# Altium schematic sheet Power_Supply.SchDoc
size A4; SheetNumber: 4; SheetTotal: 6
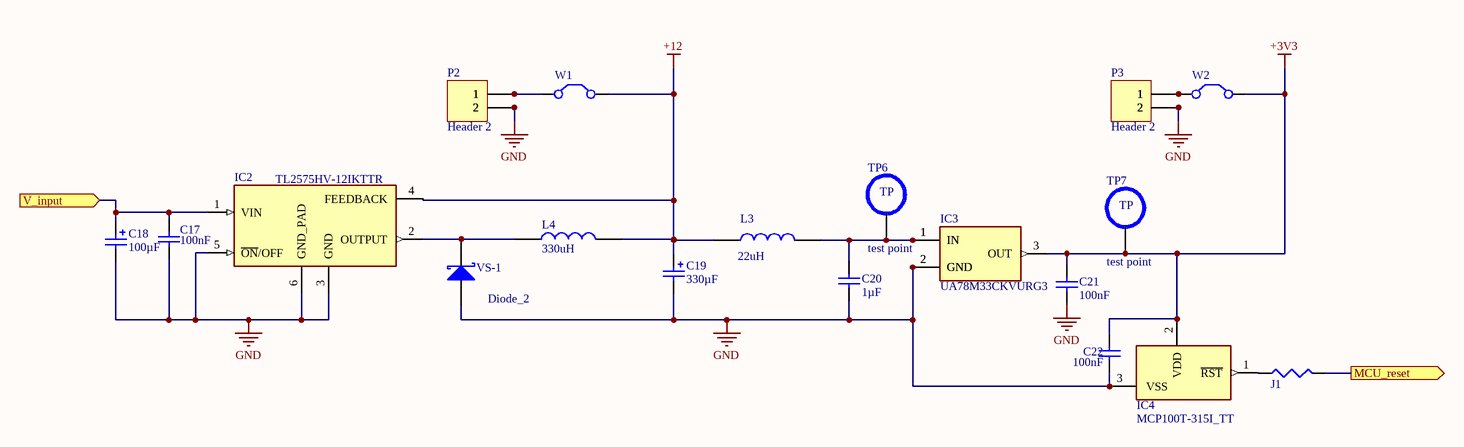
[diagram p0: Power_Supply.SchDoc]

## Parts
C17  value 100nF  [CAPC3216X180N]  (hidden comment: CC1206KKX7R0BB104)
C18  value 100µF  [EEEFK0J332AV]  (hidden comment: EEV-FK1K101V)
C19  value 330µF  [EEE0JA471UAP]  (hidden comment: EEEFK1E331P)
C20  value 1µF  [CAPC3216X180N]  (hidden comment: C1206C105M5REC7210)
C21  value 100nF  [CAPC3216X180N]  (hidden comment: CC1206KKX7R0BB104)
C22  value 100nF  [CAPC3216X180N]  (hidden comment: CC1206KKX7R0BB104)
IC2  TL2575HV-12IKTTR  [TO170P1524X483-6N]
IC3  UA78M33CKVURG3  [TPS7A6533QKVURQ1]
IC4  MCP100T-315I_TT  [SOT96P237X112-3N]
J1  MCWR12X000 PTL  [RESC3216X75N]  (value not drawn)
L3  22uH  [INDPM6965X300N]
L4  330uH  [WE-PD_7332/7345_PLASTIC_BASE54]
P2  Header 2  [HDR1X2]
P3  Header 2  [HDR1X2]
TP6  test point  [Test point]
TP7  test point  [Test point]
VS-1  Diode_2  [DIOM5436X244N]
W1  Jumper  [RAD-0.2]  (value not drawn)
W2  Jumper  [RAD-0.2]  (value not drawn)

## Ports
MCU_reset (out), V_input (in)

## Nets
+3V3: C21.2 C22.2 IC3.3(OUT) IC4.2(VDD) TP7.5 W2.2(C2)
+12: C19.1 IC2.4(FEEDBACK) L3.1 L4.2 W1.2(C2)
GND: C17.1 C18.2 C19.2 C20.1 C21.1 C22.1 IC2.3(GND) IC2.5(~{ON}/OFF) IC2.6(GND_PAD) IC3.2(GND) IC4.3(VSS) P2.2 P3.2 VS-1.2(A)
MCU_reset: J1.2 ; port MCU_reset
V_input: C17.2 C18.1 IC2.1(VIN) ; port V_input
NetC20_2: C20.2 IC3.1(IN) L3.2 TP6.5
NetIC2_2: IC2.2(OUTPUT) L4.1 VS-1.1(K)
NetIC4_1: IC4.1(~{RST}) J1.1
NetP2_1: P2.1 W1.1(C1)
NetP3_1: P3.1 W2.1(C1)

## Notes on the sheet
- (in symbol test point) TP

## Library data of the parts
C17 C21 C22 = CC1206KKX7R0BB104: Capacitor 100nF; Published: 8-Jun-2000; LatestRevisionDate: 17-Jul-2002; LatestRevisionNote: Re-released for DXP Platform.; PackageReference: RAD-0.3; Publisher: Altium Limited; PackageDescription: Radial Cap, Thru-Hole; 2 Leads; 0.3 in Pin Spacing; Supplier 1: Farnell
C18 = EEV-FK1K101V: Capacitor 100uF; Manufacturer_Name: Panasonic; Datasheet Link: http://industrial.panasonic.com/cdbs/www-data/pdf/RDE0000/ABA0000C1181.pdf; Height: 14.3mm; Manufacturer_Part_Number: EEV-FK1K101V; Mouser Part Number: 667-EEV-FK1K101V; Mouser Price/Stock: https://www.mouser.co.uk/ProductDetail/Panasonic/EEV-FK1K101V?qs=MtOUKumLmnbTFvRMlB7%2FdA%3D%3D; Supplier 1: Mouser
C19 = EEEFK1E331P: Capacitor 330uF; Manufacturer_Name: Panasonic; Manufacturer_Part_Number: EEV-FK1K101V; Datasheet Link: http://industrial.panasonic.com/cdbs/www-data/pdf/RDE0000/ABA0000C1181.pdf; Height: 14.3mm; Mouser Part Number: 667-EEV-FK1K101V; Mouser Price/Stock: https://www.mouser.co.uk/ProductDetail/Panasonic/EEV-FK1K101V?qs=MtOUKumLmnbTFvRMlB7%2FdA%3D%3D; Supplier 1: Mouser
C20 = C1206C105M5REC7210: Capacitor 1uF; Published: 8-Jun-2000; LatestRevisionDate: 17-Jul-2002; LatestRevisionNote: Re-released for DXP Platform.; PackageReference: RAD-0.3; Publisher: Altium Limited; PackageDescription: Radial Cap, Thru-Hole; 2 Leads; 0.3 in Pin Spacing; Supplier 1: Farnell
IC2 = TL2575HV-12IKTTR: Integrated Circuit; Manufacturer_Name: Texas Instruments; Datasheet Link: http://www.ti.com/lit/ds/symlink/tl2575-15.pdf; Height: 5.13mm; Manufacturer_Part_Number: TL2575HV-12IKTTR; Mouser Part Number: 595-TL2575HV-12IKTTR; Mouser Price/Stock: https://www.mouser.co.uk/ProductDetail/Texas-Instruments/TL2575HV-12IKTTR?qs=EnLMdcWnKADDmW7d51Om1g%3D%3D; Arrow Part Number: TL2575HV-12IKTTR; Arrow Price/Stock: https://www.arrow.com/en/products/tl2575hv-12ikttr/texas-instruments?region=nac
IC3 = UA78M33CKVURG3: Integrated Circuit; Manufacturer_Name: Texas Instruments; Datasheet Link: https://www.ti.com/lit/gpn/ua78m?HQS=ti-null-null-sf-df-pf-sep-wwe&DCM=yes; Height: 2.52mm; Manufacturer_Part_Number: UA78M33CKVURG3; Mouser Part Number: 595-UA78M33CKVURG3; Mouser Price/Stock: https://www.mouser.co.uk/ProductDetail/Texas-Instruments/UA78M33CKVURG3?qs=0O%2FZFlpUpJXrDg4gfD1Q2g%3D%3D; Arrow Part Number: UA78M33CKVURG3; Arrow Price/Stock: https://www.arrow.com/en/products/ua78m33ckvurg3/texas-instruments
IC4 = MCP100T-315I_TT: Integrated Circuit; Manufacturer_Name: Microchip; Manufacturer_Part_Number: MCP100T-315I/TT; Datasheet Link: http://docs-emea.rs-online.com/webdocs/0d03/0900766b80d034b8.pdf; Height: 1.12mm; Mouser Part Number: 579-MCP100T-315I/TT; Mouser Price/Stock: https://www.mouser.co.uk/ProductDetail/Microchip-Technology/MCP100T-315I-TT?qs=cQYLKLPzRJnnE4Sa6znIFg%3D%3D; Arrow Part Number: MCP100T-315I/TT; Arrow Price/Stock: https://www.arrow.com/en/products/mcp100t-315itt/microchip-technology?region=nac
J1 = MCWR12X000 PTL: Zero ohm resistor; Value: 0
L3 = IHLP2525CZER220M11: Inductor 22uH; Manufacturer_Name: Vishay; Datasheet Link: https://componentsearchengine.com/Datasheets/1/IHLP2525CZER220M11.pdf; Height: 3mm; Manufacturer_Part_Number: IHLP2525CZER220M11; Mouser Part Number: 70-IHLP2525CZER220; Mouser Price/Stock: https://www.mouser.co.uk/ProductDetail/Vishay-Dale/IHLP2525CZER220M11?qs=sy7P%252B1cA09hqmhD2Kelr6g%3D%3D; Arrow Part Number: IHLP2525CZER220M11; Arrow Price/Stock: https://www.arrow.com/en/products/ihlp2525czer220m11/vishay?region=europe; Value: 22uH
L4 = 7447789233: Inductor 330uH; Manufacturer_Name: Wurth Elektronik; Manufacturer_Part_Number: 7447789233
P2 P3 = Header 2: Header, 2-Pin; LatestRevisionDate: 17-Jul-2002; LatestRevisionNote: Re-released for DXP Platform.; Publisher: Altium Limited
VS-1 = Diode_2: Schottky Rectifier / VS-10BQ060-M3/5BT; Note: Terminal 2 is the TAB and is electrically connected to the cathode; Published: 8-Jun-2000; LatestRevisionDate: 17-Jul-2002; LatestRevisionNote: Re-released for DXP Platform.; DatasheetVersion: PD-2.057B; PackageVersion: Feb-1998; PackageReference: TO-220AC; Publisher: Altium Limited; PackageDescription: TO, Thru-Hole, Vertical, Heatsink Mounted; 3 In-Line Leads (1 Absent); Pitch 2.54 mm; ComponentLink1Description: Manufacturer Link; ComponentLink1URL: http://www.irf.com/; ComponentLink2Description: Datasheet; ComponentLink2URL: http://www.irf.com/product-info/datasheets/data/10tq.pdf
W1 W2 = Jumper: Jumper Wire; Published: 24-Mar-1999; LatestRevisionDate: 17-Jul-2002; LatestRevisionNote: Re-released for DXP Platform.; PackageReference: RAD-0.2; Publisher: Altium Limited; PackageDescription: Radial Cap, Thru-Hole; 2 Leads; 0.2 in Pin Spacing